# EasyEDA Pro project BUCK_2025-06-15_05-23-50.eprj

# Schematic Schematic1
Board Name: Board1; Create Date: 2025-06-14; Page Name: P1; Project Name: BUCK_2025-06-15_05-23-50; Schematic Name: Schematic1; Update Date: 2025-06-15; Company: 嘉立创EDA; Page Size: A4; Version: V1.0
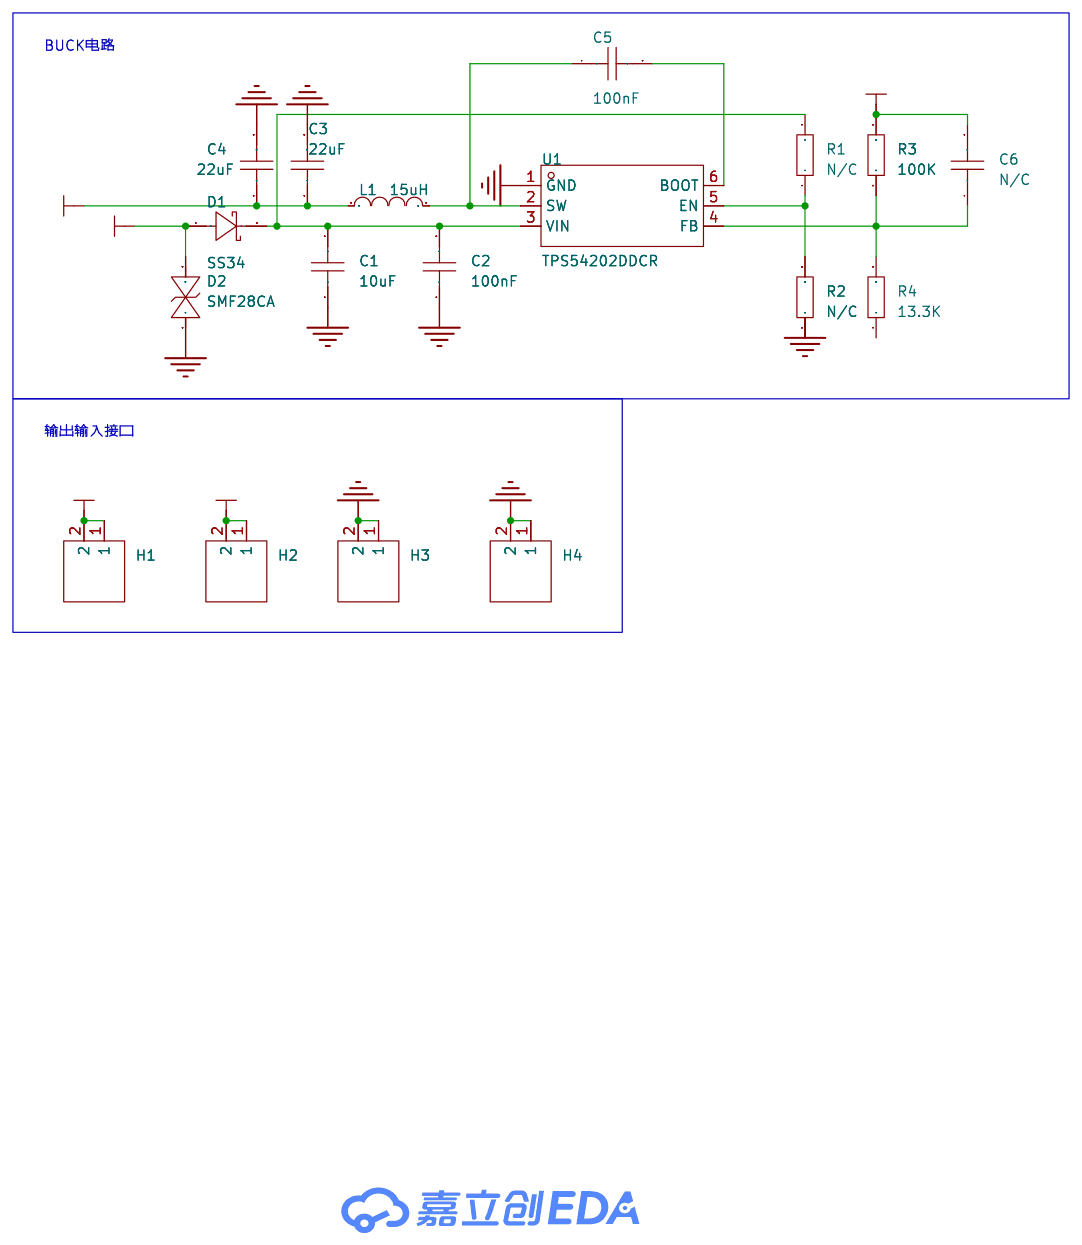
[diagram p0: schematic sheet]

## Parts
C1  10uF  [C1206]
C2  100nF  [C0603]
C3  22uF  [C0805]
C4  22uF  [C0805]
C5  100nF  [C0603]
C6  N/C  [C0603]
D1  SS34  [SMA_L4.3-W2.6-LS5.0-FD]
D2  SMF28CA  [SOD-123FL_L2.7-W1.8-LS3.8-BI]
H1  -  [HDR-TH_2P-P2.54-V-M-1]
H2  -  [HDR-TH_2P-P2.54-V-M-1]
H3  -  [HDR-TH_2P-P2.54-V-M-1]
H4  -  [HDR-TH_2P-P2.54-V-M-1]
L1  15uH  [IND-SMD_L7.0-W6.6_FXL0630]
R1  N/C  [R0603]
R2  N/C  [R0603]
R3  100K  [R0603]
R4  13.3K  [R0603]
U1  TPS54202DDCR  [SOT-23-6_L2.9-W1.6-P0.95-LS2.8-BL]

## Library data of the parts
C1 = CAP_1206: Supplier Footprint: 1206
C2 C5 C6 = CAP_0603: Supplier Footprint: 0603
C3 C4 = CAP_0805: Supplier Footprint: 0805
D1 = SS34_C7420365: LCSC Part Name: 电压:40V 电流:3A; Supplier Part: C7420365; Manufacturer: 宏迦橙; Supplier Footprint: SMA(DO-214AC); JLCPCB Part Class: 扩展库; Datasheet: https://atta.szlcsc.com/upload/public/pdf/source/20230828/75438452AEE6C276EDA92B2AF599BE05.pdf; Supplier: LCSC; Diode Configuration: 独立式; Forward Voltage (Vf@If): 550mV@3.0A; Reverse Voltage (Vr): 40V; Average Rectified Current (Io): 3A; Reverse Leakage Current (Ir): 200uA@40V; Peak forward surge current: 80A
D2 = SMF28CA_C19077517: Supplier Part: C19077517; Manufacturer: 宏迦橙; Supplier Footprint: SOD-123FL; JLCPCB Part Class: 扩展库; Datasheet: https://atta.szlcsc.com/upload/public/pdf/source/20231129/4813F17DC56F8B344A8D004597B3633C.pdf; Supplier: LCSC; polarity: 双向; Reverse Stand-Off Voltage (Vrwm): 28V; Maximum Clamping Voltage: 45.4V; Peak Pulse Current (Ipp)@10/1000us: 4.4A; Peak Pulse Power Dissipation (Ppp)@10/1000us: 200W; Breakdown Voltage: 34.4V; Reverse Leakage Current (Ir): 1uA; Operating Temperature: -55℃~+155℃; Type: TVS
H1-H4 = HDR-M_2.54_1x2P: Supplier Part: C124375; Supplier Footprint: 插件
L1 = FXL0630-150-M: LCSC Part Name: 15uH ±20% 4.5A; Supplier Part: C177243; Manufacturer: cjiang(长江微电); Supplier Footprint: SMD,6.6x7mm; JLCPCB Part Class: 扩展库; Datasheet: https://atta.szlcsc.com/upload/public/pdf/source/20240426/3189EA8206330E2108542F9E34E540E7.pdf; Supplier: LCSC; Tolerance: ±20%; Rated Current: 3A; Saturation Current (Isat): 4.5A; DC Resistance (DCR): 115mΩ; Type: 一体成型电感
R1-R4 = Res_0603: Supplier Footprint: 0603
U1 = TPS54202DDCR: LCSC Part Name: 4.5V至28V输入、2A输出、低EMI同步降压转换器; Supplier Part: C191884; Manufacturer: TI(德州仪器); Supplier Footprint: SOT-23-6; JLCPCB Part Class: 扩展库; Datasheet: https://www.ti.com/cn/lit/gpn/tps54202; Supplier: LCSC; Function: 降压型; Output Type: 可调; Voltage - Supply: 4.5V~28V; Output Current: 2A; Frequency - Switching: 500kHz; Operating Temperature: -40℃~+125℃@(TJ); Synchronous Rectifier: 是; Number of Outputs: 1; Topology: 降压式; Switch tube (built-in/external): 内置

## Nets
GND: C1.1 C2.1 C3.2 C4.2 D2.1 H3.1 H3.2 H4.1 H4.2 R2.1 U1.1(GND)
VIN: D1.1(A) D2.2 H1.1 H1.2
VOUT: C3.1 C4.1 C6.2 H2.1 H2.2 L1.1 R3.2
$1N377: C1.2 C2.2 D1.2(K) R1.2 U1.3(VIN)
$1N628: C5.1 L1.2 U1.2(SW)
$1N887: C5.2 U1.6(BOOT)
$1N1686: C6.1 R3.1 R4.2 U1.4(FB)
$1N1692: R1.1 R2.2 U1.5(EN)

Not connected (* = marked no-connect by the designer): R4 1

## Notes on the sheet
- BUCK电路
- 输出输入接口

# Board PCB1
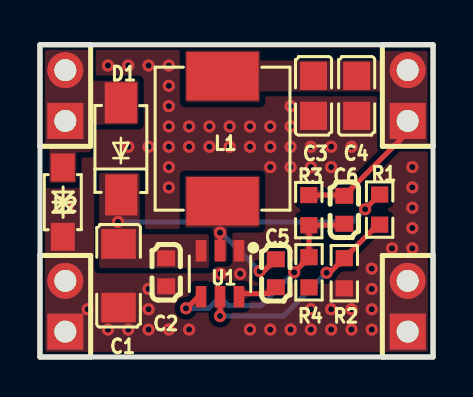
[diagram p1: board, top side]
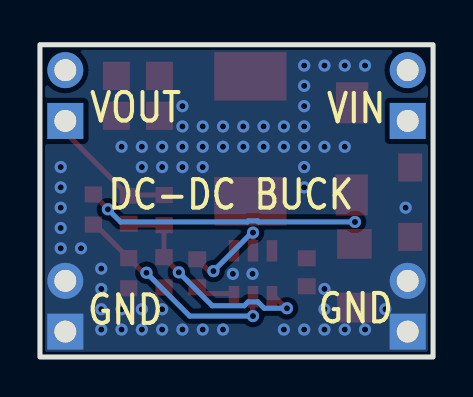
[diagram p2: board, bottom side, seen from below]

Outline 19.69 x 15.62 mm; copper layers: Top Layer, Bottom Layer. Coordinates in mm from the lower left corner of the outline.
Outline path: rectangle 0,15.62 19.69,0
Stack: Top Layer 0.035mm / Dielectric1 1.51mm FR4 er 4.5 / Bottom Layer 0.035mm

## Design rules (mm)
template: 自定义配置
spacing copperThickness1oz (default): track to track 0.102, other pairs 0.152 to 0.3
spacing copperThickness2oz: track to track 0.203, other pairs 0.152 to 0.3
track width copperThickness1oz (default): min 0.127, default 0.254, max 2.54
track width copperThickness2oz: min 0.203, default 0.254, max 2.54
differential pair differentialPair (default): width min 0.127, default 0.254, max 2.54; gap min 0.152, default 0.152
via viaSize (default): diameter min 0.5, default 0.61, max 10; hole min 0.3, default 0.305, max 6.3

## Placement (name value [footprint] x y rotation side)
C1  10uF  [C1206]  3.94 4.06 90 top
C2  100nF  [C0603]  6.32 4.24 90 top
C3  22uF  [C0805]  13.7 13.06 270 top
C4  22uF  [C0805]  15.86 13.06 270 top
C5  100nF  [C0603]  11.81 4.19 270 top
C6  N/C  [C0603]  15.24 7.37 90 top
D1  SS34  [SMA_L4.3-W2.6-LS5.0-FD]  4.06 10.41 270 top
D2  SMF28CA  [SOD-123FL_L2.7-W1.8-LS3.8-BI]  1.14 7.75 90 top
H1  -  [HDR-TH_2P-P2.54-V-M-1]  1.27 13.08 90 top
H2  -  [HDR-TH_2P-P2.54-V-M-1]  18.41 13.08 90 top
H3  -  [HDR-TH_2P-P2.54-V-M-1]  1.27 2.54 90 top
H4  -  [HDR-TH_2P-P2.54-V-M-1]  18.41 2.54 90 top
L1  15uH  [IND-SMD_L7.0-W6.6_FXL0630]  9.14 10.92 90 top
R1  N/C  [R0603]  17.01 7.37 90 top
R2  N/C  [R0603]  15.24 4.19 90 top
R3  100K  [R0603]  13.46 7.35 90 top
R4  13.3K  [R0603]  13.47 4.24 90 top
U1  TPS54202DDCR  [SOT-23-6_L2.9-W1.6-P0.95-LS2.8-BL]  9.02 4.17 180 top

## Footprints (pads in the part's own frame, mm; a bottom-side part is the same pattern mirrored in y, then rotated)
C0603
  rect 0.8x0.9 smd: 1(-0.7,0) 2(0.7,0)
C0805
  rect 1.41x1.35 smd: 1(-1,0) 2(1,0)
C1206
  rect 1.485x1.728 smd: 1(-1.593,0) 2(1.593,0)
HDR-TH_2P-P2.54-V-M-1
  rect 1.8x1.8 hole 1.1: 1(-1.27,0)
  round 1.8 hole 1.1: 2(1.27,0)
IND-SMD_L7.0-W6.6_FXL0630
  rect 2.424x3.62 smd: 1(3.128,0) 2(-3.128,0)
R0603
  rect 0.806x0.864 smd: 1(-0.753,0) 2(0.753,0)
SMA_L4.3-W2.6-LS5.0-FD
  rect 2.046x1.62 smd: 1(-2.304,-0.009) 2(2.304,0.009)
SOD-123FL_L2.7-W1.8-LS3.8-BI
  rect 1.4x1.2 smd: 1(-1.735,0) 2(1.735,0)
SOT-23-6_L2.9-W1.6-P0.95-LS2.8-BL
  rect 0.532x1.072 smd: 1(-0.95,-1.149) 2(0,-1.149) 3(0.95,-1.149) 4(0.95,1.149) 5(0,1.149) 6(-0.95,1.149)

## Nets
As in the schematic.

Pads without a net: R4 1

## Via types
v1: diameter 0.61, hole 0.305, Top Layer to Bottom Layer, 70 vias

## Routing (per net, layer and track width the routed paths; a pad name or vN(x,y) marks a point on that pad's centre or on a via; arc(x,y) is an arc through that point)
GND:
  vias: v1(1.37,7.47) v1(2.39,2.39) v1(3.41,14.58) v1(3.41,1.37) v1(4.42,14.58) v1(4.42,10.52) v1(4.42,1.37) v1(5.44,14.58) v1(5.44,10.52) v1(5.44,3.41) v1(5.44,2.39) v1(5.44,1.37) v1(6.45,14.58) v1(6.45,13.57) v1(6.45,12.55) v1(6.45,11.53) v1(6.45,10.52) v1(6.45,9.5) v1(6.45,8.49) v1(6.45,1.37) v1(7.47,11.53) v1(7.47,10.52) v1(7.47,1.37) v1(8.49,11.53) v1(8.49,10.52) v1(9.04,4.16) v1(9.5,11.53) v1(9.5,10.52) v1(10.03,4.16) v1(10.52,11.53) v1(10.52,10.52) v1(10.52,1.37) v1(11.53,11.53) v1(11.53,10.52) v1(11.53,9.5) v1(11.53,1.37) v1(12.55,12.55) v1(12.55,11.53) v1(12.55,10.52) v1(12.55,9.5) v1(12.55,1.37) v1(13.57,10.52) v1(13.57,9.5) v1(13.57,2.39) v1(13.57,1.37) v1(14.58,10.52) v1(14.58,9.5) v1(14.58,2.39) v1(14.58,1.37) v1(15.6,10.52) v1(15.6,2.39) v1(15.6,1.37) v1(16.61,4.42) v1(16.61,3.41) v1(16.61,2.39) v1(16.61,1.37) v1(17.63,5.44) v1(18.65,9.5) v1(18.65,8.49) v1(18.65,7.47) v1(18.65,6.45) v1(18.65,5.44)
VOUT: length 6.9
  Top Layer w0.254: H2.1 18.41,11.24 C6.2 15.2,8.1 R3.2
$1N377: length 13.7
  Top Layer w0.254: R1.2 16.28,7.4 v1(16.28,7.39)
  Bottom Layer w0.254: v1(3.91,6.76) 8.72,6.76 8.78,6.81 9.26,6.81 9.31,6.76 15.65,6.76 v1(16.28,7.39)
$1N628: length 4.7
  Top Layer w0.254: C5.1 11.22,4.3 v1(11,4.3) ; v1(9.02,6.22) U1.2
  Bottom Layer w0.254: v1(11,4.3) 9.07,6.22 v1(9.02,6.22)
$1N887: length 2
  Top Layer w0.254: 9.98,3.17 11.49,3.17 C5.2
$1N1686: length 11.9
  Top Layer w0.254: C6.1 15.17,6.6 R3.1 13.47,6.58 R4.2 13.47,4.98 v1(12.73,4.24) ; v1(7.31,2.44) 7.35,2.44 8.08,3.17
  Bottom Layer w0.254: v1(12.73,4.24) 11.06,2.57 9.45,2.57 9.26,2.76 8.78,2.76 8.45,2.44 v1(7.31,2.44)
$1N1692: length 11
  Top Layer w0.254: v1(14.35,4.22) 14.51,4.22 R2.2 16.92,6.62 17.01,6.62 ; 9.03,3.17 9.03,2.06 v1(9.02,2.05)
  Bottom Layer w0.254: v1(9.02,2.05) 12.19,2.05 v1(14.35,4.22)

## Copper pours and planes (outline as drawn; the poured copper is in the pictures)
GND on Top Layer: 0,15.62 19.69,15.62 19.69,0 0,0
GND on Bottom Layer: 0,15.62 19.69,15.62 19.69,0 0,0
VIN on Top Layer: 0,15.62 2.54,15.62 2.54,13.84 2.57,13.82 4.94,13.82 4.94,11.65 4.93,11.63 2.54,11.63 2.54,10.24 1.83,10.24 1.83,8.7 0.46,8.7 0.46,10.54 0,10.54
VOUT on Top Layer: 7.26,15.34 7.26,12.75 11.03,12.75 11.03,13.29 17.15,13.29 17.15,10.54 19.38,10.54 19.41,10.52 19.41,15.32 17.15,15.32 17.15,14.84 11.03,14.84 11.03,15.34 7.27,15.34
$1N377 on Top Layer: 2.95,9.22 5,9.22 5,6.17 5.03,6.15 8.47,6.15 8.47,4.45 8.46,4.44 2.96,4.44 2.96,9.2
$1N628 on Top Layer: 9.37,4.77 8.64,4.77 8.64,6.48 7.26,6.48 7.26,9.07 11.02,9.07 11.02,6.48 11.02,6.48 9.37,6.48 9.37,4.78

Small or netless copper shapes (teardrops, artwork), in the pictures only: 24 on Top Layer, 5 on Bottom Layer

## Text on the board
Bottom Silkscreen Layer: VIN | GND | DC-DC BUCK | VOUT
